# EAGLE schematic IV51 (EAGLE 6.1)
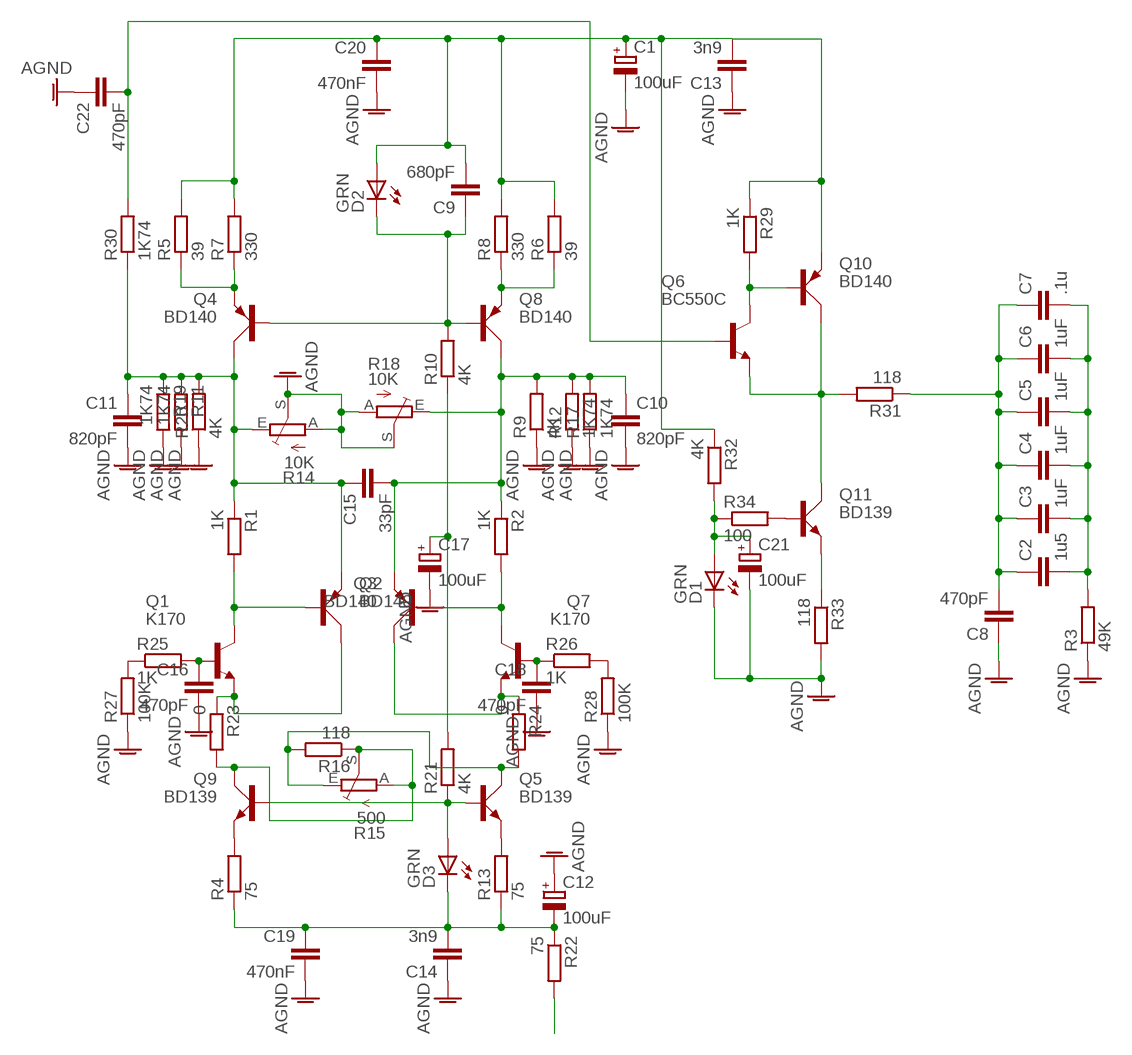
[diagram p0: schematic, sheet 1]

## Parts
C1  100uF  CPOL-EUE5-10.5  [E5-10,5]
C2  1u5  C-EU275-134X316  [C275-134X316]
C3  1uF  C-EU275-134X316  [C275-134X316]
C4  1uF  C-EU275-134X316  [C275-134X316]
C5  1uF  C-EU275-134X316  [C275-134X316]
C6  1uF  C-EU275-134X316  [C275-134X316]
C7  .1u  C-EU050-075X075  [C050-075X075]
C8  470pF  C-EU102-043X133  [C102-043X133]
C9  680pF  C-EU050-045X075  [C050-045X075]
C10  820pF  C-EU075-032X103  [C075-032X103]
C11  820pF  C-EU075-032X103  [C075-032X103]
C12  100uF  CPOL-EUE5-10.5  [E5-10,5]
C13  3n9  C-EUC1210  [C1210]
C14  3n9  C-EUC1210  [C1210]
C15  33pF  C-EUC1210  [C1210]
C16  470pF  C-EU102-043X133  [C102-043X133]
C17  100uF  CPOL-EUE3.5-8  [E3,5-8]
C18  470pF  C-EU102-043X133  [C102-043X133]
C19  470nF  C-EU102-043X133  [C102-043X133]
C20  470nF  C-EU102-043X133  [C102-043X133]
C21  100uF  CPOL-EUE3.5-8  [E3,5-8]
C22  470pF  C-EU075-042X103  [C075-042X103]
D1  GRN  SFH482  [SFH482]
D2  GRN  SFH482  [SFH482]
D3  GRN  SFH482  [SFH482]
Q1  K170  BC549B  [TO92-EBC]
Q2  BD140  [TO126AV]
Q3  BD140  [TO126AV]
Q4  BD140  [TO126AV]
Q5  BD139  [TO126AV]
Q6  BC550C  BC549B  [TO92-EBC]
Q7  K170  BC549B  [TO92-EBC]
Q8  BD140  [TO126AV]
Q9  BD139  [TO126AV]
Q10  BD140  [TO126AV]
Q11  BD139  [TO126AV]
R1  1K  R-EU_0309/12  [0309/12]
R2  1K  R-EU_0309/12  [0309/12]
R3  49K  R-EU_0309/12  [0309/12]
R4  75  R-EU_0309/12  [0309/12]
R5  39  R-EU_0309/12  [0309/12]
R6  39  R-EU_0309/12  [0309/12]
R7  330  R-EU_0309/12  [0309/12]
R8  330  R-EU_0309/12  [0309/12]
R9  4K  R-EU_0309/12  [0309/12]
R10  4K  R-EU_0309/12  [0309/12]
R11  1K74  R-EU_0309/12  [0309/12]
R12  1K74  R-EU_0309/12  [0309/12]
R13  75  R-EU_0309/12  [0309/12]
R14  10K  TRIM_EU-RJ9W  [RJ9W]
R15  500  TRIM_EU-PTSPIN  [PT-SPIN]
R16  118  R-EU_0309/12  [0309/12]
R17  1K74  R-EU_0309/12  [0309/12]
R18  10K  TRIM_EU-RJ9W  [RJ9W]
R19  1K74  R-EU_0309/12  [0309/12]
R20  4K  R-EU_0309/12  [0309/12]
R21  4K  R-EU_0309/12  [0309/12]
R22  75  R-EU_0309/12  [0309/12]
R23  0  R-EU_0309/10  [0309/10]
R24  0  R-EU_0309/10  [0309/10]
R25  1K  R-EU_0309/12  [0309/12]
R26  1K  R-EU_0309/12  [0309/12]
R27  100K  R-EU_0309/12  [0309/12]
R28  100K  R-EU_0309/12  [0309/12]
R29  1K  R-EU_R1210  [R1210]
R30  1K74  R-EU_0309/12  [0309/12]
R31  118  R-EU_0309/12  [0309/12]
R32  4K  R-EU_0309/12  [0309/12]
R33  118  R-EU_0309/12  [0309/12]
R34  100  R-EU_R1210  [R1210]

## Nets
AGND: C1.- C8.1 C10.2 C11.2 C12.+ C13.1 C14.1 C16.2 C17.- C18.2 C19.2 C20.2 C21.- C22.1 D1.K(C) R3.1 R9.1 R11.2 R12.1 R14.A R14.S R17.1 R18.A R18.S R19.2 R20.1 R27.1 R28.1 R33.2
N$1: Q9.E R4.2
N$2: Q4.E R5.1 R7.1
N$3: C2.1 C3.1 C4.1 C5.1 C6.1 C7.1 C8.2 R31.1
N$4: Q1.C Q2.B R1.2
N$5: C1.+ C9.2 C13.2 C20.1 D2.A Q10.E R5.2 R6.2 R7.2 R8.2 R29.1 R32.1
N$6: Q3.B Q7.C R2.2
N$7: Q5.E R13.2
N$8: C17.+ R10.1 R21.2
N$9: C16.1 Q1.B R25.2
N$10: Q3.C Q7.E R24.1
N$11: Q8.E R6.1 R8.1
N$12: C10.1 C15.2 Q3.E Q8.C R2.1 R9.2 R12.2 R17.2 R18.E
N$13: C18.1 Q7.B R26.1
N$14: C9.1 D2.K(C) Q4.B Q8.B R10.2
N$15: C22.2 Q6.B R30.2
N$16: Q1.E Q2.C R23.1
N$17: Q5.C R15.E R16.2 R24.2
N$18: Q9.C R15.A R15.S R16.1 R23.2
N$19: R25.1 R27.2
N$20: C12.- C14.2 C19.1 D3.K(C) R4.1 R13.1 R22.1
N$21: D3.A Q5.B Q9.B R21.1
N$22: R26.2 R28.2
N$23: Q6.C Q10.B R29.2
N$24: Q6.E Q10.C Q11.C R31.2
N$25: Q11.B R34.2
N$27: C11.1 C15.1 Q2.E Q4.C R1.1 R11.1 R14.E R19.1 R20.2 R30.1
N$28: R22.2
N$29: C21.+ D1.A R32.2 R34.1
N$30: Q11.E R33.1
OUT: C2.2 C3.2 C4.2 C5.2 C6.2 C7.2 R3.2

## Library data of the parts
C1 C12 C17 C21 = resistor:CPOL-EU: POLARIZED CAPACITOR, European symbol
C2-C11 C13-C16 C18-C20 C22 = resistor:C-EU: CAPACITOR, European symbol
D1-D3 = led:SFH482: IR LED infrared emitting diode, Infineon
Q1 Q6 Q7 = transistor-npn:BC549*: NPN Transistor
Q2-Q4 Q8 Q10 = transistor-power:BD140: PNP TRANSISTOR
Q5 Q9 Q11 = transistor-power:BD139: NPN TRANSISTOR
R1-R13 R16 R17 R19-R34 = resistor:R-EU_: RESISTOR, European symbol
R14 R15 R18 = pot:TRIM_EU-: POTENTIOMETER